# Altium schematic sheet MainBoard_V100_MAIN.SchDoc
size A4; SheetNumber: 2; SheetTotal: 22; Title_: Main Page
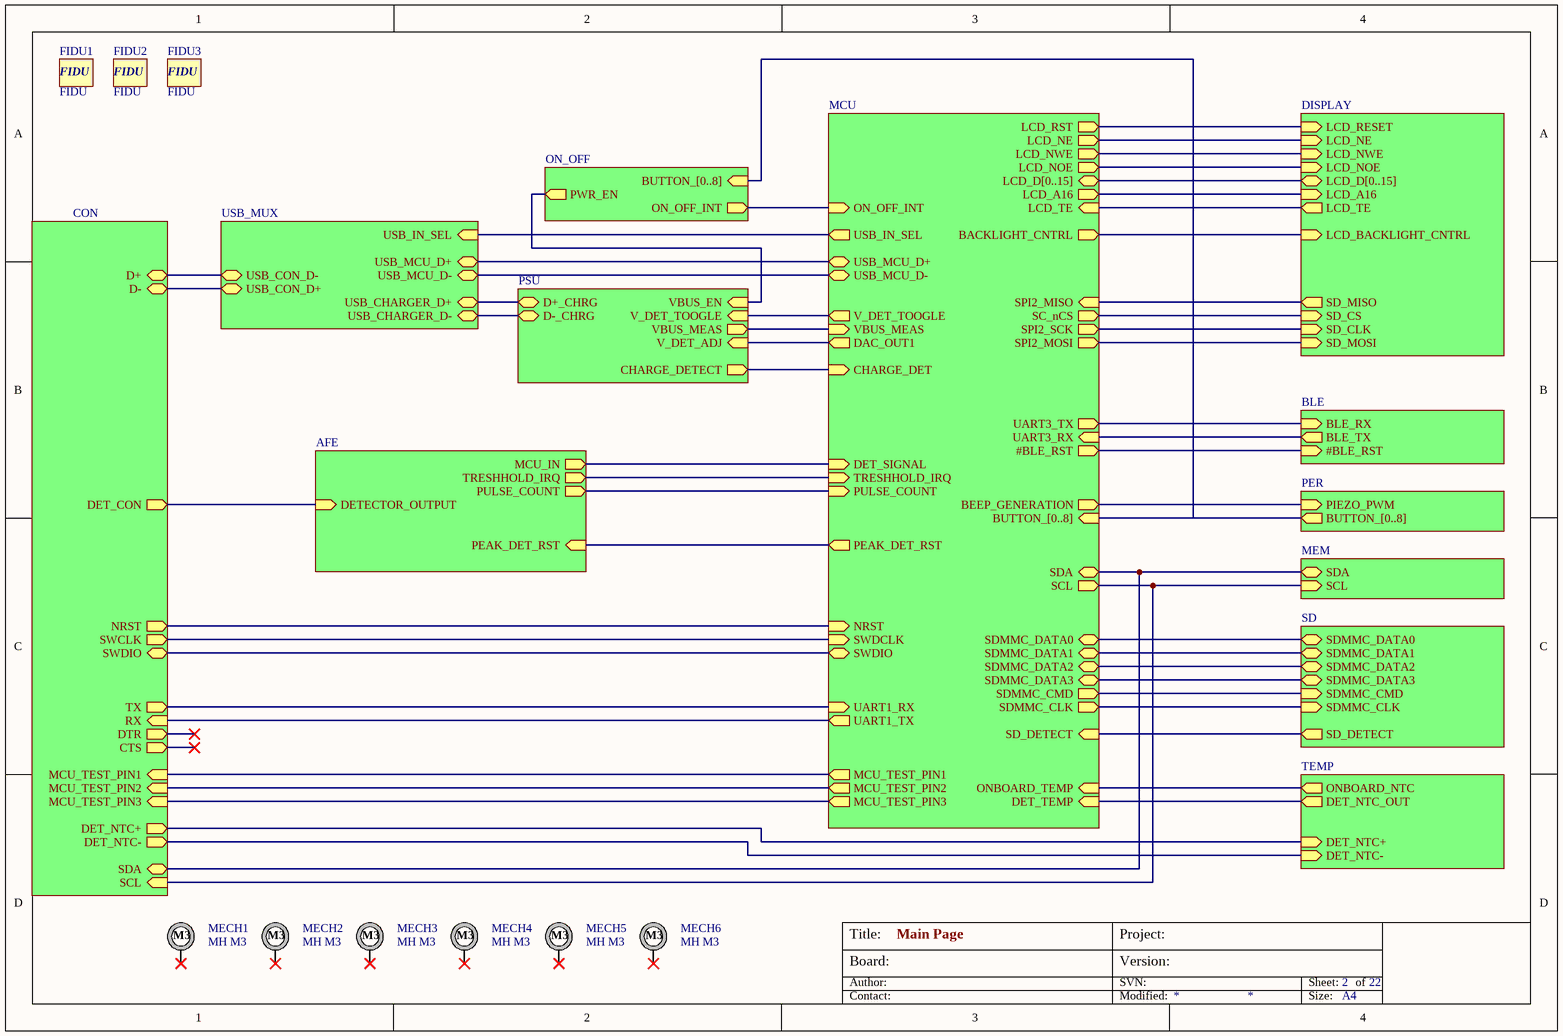
[diagram p0: MainBoard_V100_MAIN.SchDoc]

## Parts
FIDU1  FIDU  [FIDU_4x4]  (no BOM)
FIDU2  FIDU  [FIDU_4x4]  (no BOM)
FIDU3  FIDU  [FIDU_4x4]  (no BOM)
MECH1  MH M3  [PAD_M3 x 7]  (no BOM)
MECH2  MH M3  [PAD_M3 x 7]  (no BOM)
MECH3  MH M3  [PAD_M3 x 7]  (no BOM)
MECH4  MH M3  [PAD_M3 x 7]  (no BOM)
MECH5  MH M3  [PAD_M3 x 7]  (no BOM)
MECH6  MH M3  [PAD_M3 x 7]  (no BOM)

## Sub-sheets
AFE = MainBoard_V100_AFE.SchDoc: PEAK_DET_RST (in), TRESHHOLD_IRQ (out), PULSE_COUNT (out), DETECTOR_OUTPUT (in), MCU_IN (out)
BLE = MainBoard_V100_BLE.SchDoc: BLE_RX (in), BLE_TX (out), #BLE_RST (in)
CON = MainBoard_V100_CON.SchDoc: D+ (bidir), D- (bidir), CTS (out), TX (out), RX (in), DTR (out), NRST (out), SWCLK (out), SWDIO (bidir), DET_CON (out), DET_NTC+ (out), SDA (bidir), SCL (in), DET_NTC- (out), MCU_TEST_PIN1 (in), MCU_TEST_PIN2 (in), MCU_TEST_PIN3 (in)
DISPLAY = MainBoard_V100_DISP.SchDoc: LCD_RESET (in), LCD_NE (in), LCD_NWE (in), LCD_NOE (in), SD_MOSI (in), SD_CLK (in), SD_MISO (out), SD_CS (in), LCD_D[0..15] (bidir), LCD_A16 (in), LCD_TE (out), LCD_BACKLIGHT_CNTRL (in)
MCU = MainBoard_V100_MCU.SchDoc: #BLE_RST (out), BACKLIGHT_CNTRL (out), BEEP_GENERATION (out), DAC_OUT1 (out), DET_SIGNAL (in), LCD_A16 (out), LCD_D[0..15] (bidir), LCD_NE (out), LCD_NOE (out), LCD_NWE (out), LCD_RST (out), LCD_TE (in), NRST (in), ON_OFF_INT (in), PEAK_DET_RST (out), SCL (out), SDA (bidir), SDMMC_CLK (out), SDMMC_CMD (out), SD_DETECT (in), SPI2_MISO (in), SPI2_MOSI (out), SPI2_SCK (out), SWDCLK (in), SWDIO (bidir), TRESHHOLD_IRQ (in), UART1_RX (in), UART1_TX (out), UART3_RX (in), UART3_TX (out), USB_IN_SEL (out), USB_MCU_D+ (bidir), USB_MCU_D- (bidir), SDMMC_DATA3 (bidir), SDMMC_DATA2 (bidir), SDMMC_DATA0 (bidir), SDMMC_DATA1 (bidir), BUTTON_[0..8] (in), VBUS_MEAS (in), V_DET_TOOGLE (out), DET_TEMP (in), ONBOARD_TEMP (in), PULSE_COUNT (in), CHARGE_DET (in), SC_nCS (out), MCU_TEST_PIN1 (out), MCU_TEST_PIN2 (out), MCU_TEST_PIN3 (out)
MEM = MainBoard_V100_MEM.SchDoc: SDA (bidir), SCL (in)
ON_OFF = MainBoard_V100_ON_OFF.SchDoc: ON_OFF_INT (out), PWR_EN (out), BUTTON_[0..8] (in)
PER = MainBoard_V100_PER.SchDoc: PIEZO_PWM (in), BUTTON_[0..8] (out)
PSU = MainBoard_V100_PSU.SchDoc: VBUS_EN (in), VBUS_MEAS (out), D-_CHRG (bidir), D+_CHRG (bidir), V_DET_TOOGLE (in), V_DET_ADJ (in), CHARGE_DETECT (out)
SD = MainBoard_V100_SD.SchDoc: SDMMC_DATA1 (bidir), SDMMC_DATA0 (bidir), SDMMC_DATA3 (bidir), SDMMC_DATA2 (bidir), SD_DETECT (out), SDMMC_CLK (in), SDMMC_CMD (in)
TEMP = MainBoard_V100_TEMP.SchDoc: ONBOARD_NTC (out), DET_NTC- (in), DET_NTC+ (in), DET_NTC_OUT (out)
USB_MUX = MainBoard_V100_USB_MUX.SchDoc: USB_IN_SEL (in), USB_CON_D- (bidir), USB_CON_D+ (bidir), USB_MCU_D- (bidir), USB_MCU_D+ (bidir), USB_CHARGER_D- (bidir), USB_CHARGER_D+ (bidir)

## Nets
(unnamed): sheet PSU/VBUS_EN, sheet ON_OFF/PWR_EN
(unnamed): sheet PSU/VBUS_MEAS, sheet MCU/VBUS_MEAS
(unnamed): sheet PSU/D-_CHRG, sheet USB_MUX/USB_CHARGER_D-
(unnamed): sheet PSU/D+_CHRG, sheet USB_MUX/USB_CHARGER_D+
(unnamed): sheet PSU/V_DET_TOOGLE, sheet MCU/V_DET_TOOGLE
(unnamed): sheet PSU/V_DET_ADJ, sheet MCU/DAC_OUT1
(unnamed): sheet PSU/CHARGE_DETECT, sheet MCU/CHARGE_DET
(unnamed): sheet CON/D+, sheet USB_MUX/USB_CON_D-
(unnamed): sheet CON/D-, sheet USB_MUX/USB_CON_D+
(unnamed): sheet CON/TX, sheet MCU/UART1_RX
(unnamed): sheet CON/RX, sheet MCU/UART1_TX
(unnamed): sheet CON/NRST, sheet MCU/NRST
(unnamed): sheet CON/SWCLK, sheet MCU/SWDCLK
(unnamed): sheet CON/SWDIO, sheet MCU/SWDIO
(unnamed): sheet CON/DET_CON, sheet AFE/DETECTOR_OUTPUT
(unnamed): sheet CON/DET_NTC+, sheet TEMP/DET_NTC+
(unnamed): sheet CON/SDA, sheet MEM/SDA, sheet MCU/SDA
(unnamed): sheet CON/SCL, sheet MEM/SCL, sheet MCU/SCL
(unnamed): sheet CON/DET_NTC-, sheet TEMP/DET_NTC-
(unnamed): sheet CON/MCU_TEST_PIN1, sheet MCU/MCU_TEST_PIN1
(unnamed): sheet CON/MCU_TEST_PIN2, sheet MCU/MCU_TEST_PIN2
(unnamed): sheet CON/MCU_TEST_PIN3, sheet MCU/MCU_TEST_PIN3
(unnamed): sheet AFE/PEAK_DET_RST, sheet MCU/PEAK_DET_RST
(unnamed): sheet AFE/TRESHHOLD_IRQ, sheet MCU/TRESHHOLD_IRQ
(unnamed): sheet AFE/PULSE_COUNT, sheet MCU/PULSE_COUNT
(unnamed): sheet AFE/MCU_IN, sheet MCU/DET_SIGNAL
(unnamed): sheet ON_OFF/ON_OFF_INT, sheet MCU/ON_OFF_INT
(unnamed): sheet SD/SDMMC_DATA1, sheet MCU/SDMMC_DATA1
(unnamed): sheet SD/SDMMC_DATA0, sheet MCU/SDMMC_DATA0
(unnamed): sheet SD/SDMMC_DATA3, sheet MCU/SDMMC_DATA3
(unnamed): sheet SD/SDMMC_DATA2, sheet MCU/SDMMC_DATA2
(unnamed): sheet SD/SD_DETECT, sheet MCU/SD_DETECT
(unnamed): sheet SD/SDMMC_CLK, sheet MCU/SDMMC_CLK
(unnamed): sheet SD/SDMMC_CMD, sheet MCU/SDMMC_CMD
(unnamed): sheet USB_MUX/USB_IN_SEL, sheet MCU/USB_IN_SEL
(unnamed): sheet USB_MUX/USB_MCU_D-, sheet MCU/USB_MCU_D-
(unnamed): sheet USB_MUX/USB_MCU_D+, sheet MCU/USB_MCU_D+
(unnamed): sheet PER/PIEZO_PWM, sheet MCU/BEEP_GENERATION
(unnamed): sheet MCU/#BLE_RST, sheet BLE/#BLE_RST
(unnamed): sheet MCU/BACKLIGHT_CNTRL, sheet DISPLAY/LCD_BACKLIGHT_CNTRL
(unnamed): sheet MCU/LCD_A16, sheet DISPLAY/LCD_A16
(unnamed): sheet MCU/LCD_NE, sheet DISPLAY/LCD_NE
(unnamed): sheet MCU/LCD_NOE, sheet DISPLAY/LCD_NOE
(unnamed): sheet MCU/LCD_NWE, sheet DISPLAY/LCD_NWE
(unnamed): sheet MCU/LCD_RST, sheet DISPLAY/LCD_RESET
(unnamed): sheet MCU/LCD_TE, sheet DISPLAY/LCD_TE
(unnamed): sheet MCU/SPI2_MISO, sheet DISPLAY/SD_MISO
(unnamed): sheet MCU/SPI2_MOSI, sheet DISPLAY/SD_MOSI
(unnamed): sheet MCU/SPI2_SCK, sheet DISPLAY/SD_CLK
(unnamed): sheet MCU/UART3_RX, sheet BLE/BLE_TX
(unnamed): sheet MCU/UART3_TX, sheet BLE/BLE_RX
(unnamed): sheet MCU/DET_TEMP, sheet TEMP/DET_NTC_OUT
(unnamed): sheet MCU/ONBOARD_TEMP, sheet TEMP/ONBOARD_NTC
(unnamed): sheet MCU/SC_nCS, sheet DISPLAY/SD_CS

Not connected (* = marked no-connect by the designer): MECH1 M3*; MECH2 M3*; MECH3 M3*; MECH4 M3*; MECH5 M3*; MECH6 M3*

## Buses and harness runs
bus sheet DISPLAY/LCD_D[0..15] = sheet MCU/LCD_D[0..15]
bus sheet MCU/BUTTON_[0..8] = sheet ON_OFF/BUTTON_[0..8] = sheet PER/BUTTON_[0..8]

## Notes on the sheet
- Board:
- Author:
- Title:
- Project:
- SVN:
- Version:
- Sheet:
- of
- Contact:
- Modified:
- Size:
- A4

## Library data of the parts
FIDU1-FIDU3 = 275: FIDU, 4x4mm, rectangle; Azonosító: 275; Part Number: FIDU_4x4; Category: Electro-mechanicals; Subcategory: ELME_Other
MECH1-MECH6 = 268: 3.2/7mm Mounting_Hole_M3; Azonosító: 268; Part Number: Mounting_Hole_M3; Category: Electro-mechanicals; Subcategory: ELME_Other